# Altium schematic sheet MCU.SchDoc
size A2
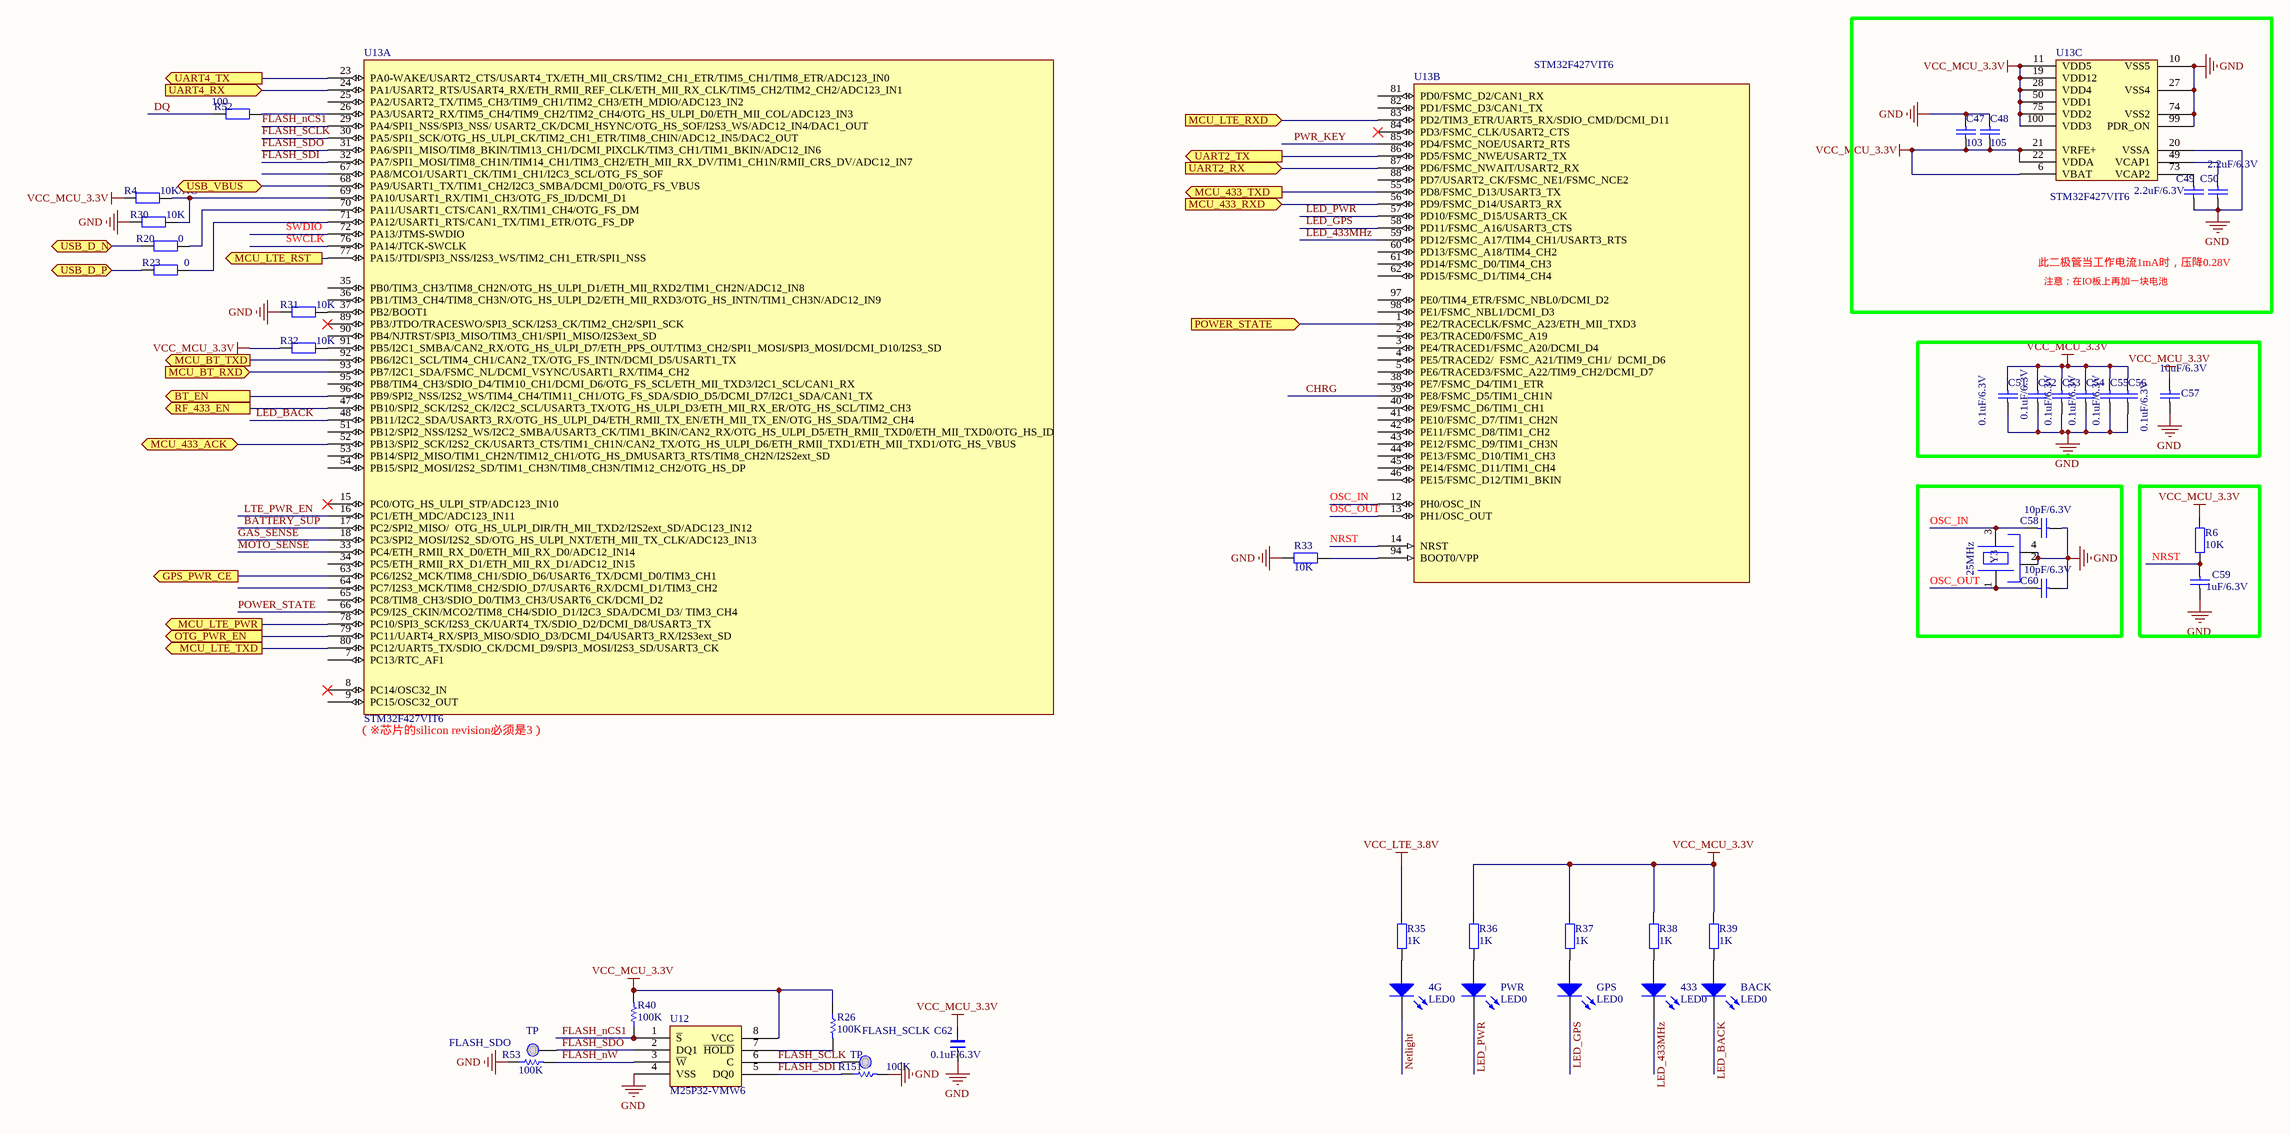
[diagram p0: MCU.SchDoc]

## Parts
4G  LED0  [LED_DIP_3mm]
433  LED0  [LED_DIP_3mm]
BACK  LED0  [LED_DIP_3mm]
C47  103  [0603C]
C48  105  [0603C]
C49  2.2uF/6.3V  [0603C]
C50  2.2uF/6.3V  [0603C]
C51  0.1uF/6.3V  [0603C]
C52  0.1uF/6.3V  [0603C]
C53  0.1uF/6.3V  [0603C]
C54  0.1uF/6.3V  [0603C]
C55  0.1uF/6.3V  [0603C]
C56  0.1uF/6.3V  [0603C]
C57  10uF/6.3V  [0805C]
C58  10pF/6.3V  [0603C]
C59  1uF/6.3V  [0603C]
C60  10pF/6.3V  [0603C]
C62  0.1uF/6.3V  [0603C]
FLASH_SCLK  TP  [tpd]
FLASH_SDO  TP  [tpd]
GPS  LED0  [LED_DIP_3mm]
PWR  LED0  [LED_DIP_3mm]
R4  value 10K/NC  [0603R]  (hidden comment: 10K)
R6  10K  [0603R]
R20  0  [0603R]
R23  0  [0603R]
R26  100K  [0603R]
R30  10K  [0603R]
R31  10K  [0603R]
R32  10K  [0603R]
R33  10K  [0603R]
R35  1K  [0603R]
R36  1K  [0603R]
R37  1K  [0603R]
R38  1K  [0603R]
R39  1K  [0603R]
R40  100K  [0603R]
R52  100  [0603R]
R53  100K  [0603R]
R151  100K  [0603R]
U12  M25P32-VMW6  [SOIC127P790X216-8N]
U13  STM32F427VIT6  [LQFQ100-stm32f103v]  (parts A,B,C of 3)
Y3  25MHz  [OSCILLATOR-3.2X2.5]

## Blocks framed on the sheet
此二极管当工作电流1mA时，压降0.28V: C47-C50 U13

## Ports
BT_EN (out), GPS_PWR_CE (out), MCU_433_ACK (bidir), MCU_433_RXD (in), MCU_433_TXD (out), MCU_BT_RXD (in), MCU_BT_TXD (out), MCU_LTE_PWR (out), MCU_LTE_RST (out), MCU_LTE_RXD (in), MCU_LTE_TXD (out), OTG_PWR_EN (out), POWER_STATE (in), RF_433_EN (out), UART2_RX (in), UART2_TX (out), UART4_RX (in), UART4_TX (out), USB_D_N, USB_D_P, USB_VBUS (bidir)

## Nets
GND: C47.2 C48.2 C49.1 C50.1 C51.1 C52.1 C53.1 C54.1 C55.1 C56.1 C57.2 C58.1 C59.1 C60.1 C62.1 R30.2 R31.2 R33.2 R53.1 R151.2 U12.4(VSS) U13.10(VSS5) U13.20(VSSA) U13.27(VSS4) U13.74(VSS2) U13.99(PDR_ON) Y3.2(GND) Y3.4(GND)
VCC_LTE_3.8V: R35.1
VCC_MCU_3.3V: C47.1 C48.1 C51.2 C52.2 C53.2 C54.2 C55.2 C56.2 C57.1 C62.2 R4.2 R6.2 R26.1 R32.2 R36.1 R37.1 R38.1 R39.1 R40.2 U12.8(VCC) U13.6(VBAT) U13.11(VDD5) U13.19(VDD12) U13.21(VRFE+) U13.22(VDDA) U13.28(VDD4) U13.50(VDD1) U13.75(VDD2) U13.100(VDD3)
BATTERY_SUP: U13.17(PC2/SPI2_MISO/__OTG_HS_ULPI_DIR/TH_MII_TXD2/I2S2ext_SD/ADC123_IN12)
BT_EN: U13.96(PB9/SPI2_NSS/I2S2_WS/TIM4_CH4/TIM11_CH1/OTG_FS_SDA/SDIO_D5/DCMI_D7/I2C1_SDA/CAN1_TX) ; port BT_EN
CHRG: U13.39(PE8/FSMC_D5/TIM1_CH1N)
DQ: R52.2
FLASH_nCS1: R40.1 U12.1(~{S}) U13.29(PA4/SPI1_NSS/SPI3_NSS/_USART2_CK/DCMI_HSYNC/OTG_HS_SOF/I2S3_WS/ADC12_IN4/DAC1_OUT)
FLASH_nW: R53.2 U12.3(~{W})
FLASH_SCLK: FLASH_SCLK.1 U12.6(C) U13.30(PA5/SPI1_SCK/OTG_HS_ULPI_CK/TIM2_CH1_ETR/TIM8_CHIN/ADC12_IN5/DAC2_OUT)
FLASH_SDI: R151.1 U12.5(DQ0) U13.32(PA7/SPI1_MOSI/TIM8_CH1N/TIM14_CH1/TIM3_CH2/ETH_MII_RX_DV/TIM1_CH1N/RMII_CRS_DV/ADC12_IN7)
FLASH_SDO: FLASH_SDO.1 U12.2(DQ1) U13.31(PA6/SPI1_MISO/TIM8_BKIN/TIM13_CH1/DCMI_PIXCLK/TIM3_CH1/TIM1_BKIN/ADC12_IN6)
GAS_SENSE: U13.18(PC3/SPI2_MOSI/I2S2_SD/OTG_HS_ULPI_NXT/ETH_MII_TX_CLK/ADC123_IN13)
GPS_PWR_CE: U13.63(PC6/I2S2_MCK/TIM8_CH1/SDIO_D6/USART6_TX/DCMI_D0/TIM3_CH1) ; port GPS_PWR_CE
LED_433MHz: 433.2(K) U13.59(PD12/FSMC_A17/TIM4_CH1/USART3_RTS)
LED_BACK: BACK.2(K) U13.48(PB11/I2C2_SDA/USART3_RX/OTG_HS_ULPI_D4/ETH_RMII_TX_EN/ETH_MII_TX_EN/OTG_HS_SDA/TIM2_CH4)
LED_GPS: GPS.2(K) U13.58(PD11/FSMC_A16/USART3_CTS)
LED_PWR: PWR.2(K) U13.57(PD10/FSMC_D15/USART3_CK)
LTE_PWR_EN: U13.16(PC1/ETH_MDC/ADC123_IN11)
MCU_433_ACK: U13.52(PB13/SPI2_SCK/I2S2_CK/USART3_CTS/TIM1_CH1N/CAN2_TX/OTG_HS_ULPI_D6/ETH_RMII_TXD1/ETH_MII_TXD1/OTG_HS_VBUS) ; port MCU_433_ACK
MCU_433_RXD: U13.56(PD9/FSMC_D14/USART3_RX) ; port MCU_433_RXD
MCU_433_TXD: U13.55(PD8/FSMC_D13/USART3_TX) ; port MCU_433_TXD
MCU_BT_RXD: U13.93(PB7/I2C1_SDA/FSMC_NL/DCMI_VSYNC/USART1_RX/TIM4_CH2) ; port MCU_BT_RXD
MCU_BT_TXD: U13.92(PB6/I2C1_SCL/TIM4_CH1/CAN2_TX/OTG_FS_INTN/DCMI_D5/USART1_TX) ; port MCU_BT_TXD
MCU_LTE_PWR: U13.78(PC10/SPI3_SCK/I2S3_CK/UART4_TX/SDIO_D2/DCMI_D8/USART3_TX) ; port MCU_LTE_PWR
MCU_LTE_RST: U13.77(PA15/JTDI/SPI3_NSS/I2S3_WS/TIM2_CH1_ETR/SPI1_NSS) ; port MCU_LTE_RST
MCU_LTE_RXD: U13.83(PD2/TIM3_ETR/UART5_RX/SDIO_CMD/DCMI_D11) ; port MCU_LTE_RXD
MCU_LTE_TXD: U13.80(PC12/UART5_TX/SDIO_CK/DCMI_D9/SPI3_MOSI/I2S3_SD/USART3_CK) ; port MCU_LTE_TXD
MOTO_SENSE: U13.33(PC4/ETH_RMII_RX_D0/ETH_MII_RX_D0/ADC12_IN14)
Netlight: 4G.2(K)
NRST: C59.2 R6.1 U13.14(NRST)
OSC_IN: C58.2 U13.12(PH0/OSC_IN) Y3.3
OSC_OUT: C60.2 U13.13(PH1/OSC_OUT) Y3.1
OTG_PWR_EN: U13.79(PC11/UART4_RX/SPI3_MISO/SDIO_D3/DCMI_D4/USART3_RX/I2S3ext_SD) ; port OTG_PWR_EN
POWER_STATE: U13.66(PC9/I2S_CKIN/MCO2/TIM8_CH4/SDIO_D1/I2C3_SDA/DCMI_D3/_TIM3_CH4)
POWER_STATE: U13.1(PE2/TRACECLK/FSMC_A23/ETH_MII_TXD3) ; port POWER_STATE  [a separate net that carries the same name]
PWR_KEY: U13.85(PD4/FSMC_NOE/USART2_RTS)
RF_433_EN: U13.47(PB10/SPI2_SCK/I2S2_CK/I2C2_SCL/USART3_TX/OTG_HS_ULPI_D3/ETH_MII_RX_ER/OTG_HS_SCL/TIM2_CH3) ; port RF_433_EN
SWCLK: U13.76(PA14/JTCK-SWCLK)
SWDIO: U13.72(PA13/JTMS-SWDIO)
UART2_RX: U13.87(PD6/FSMC_NWAIT/USART2_RX) ; port UART2_RX
UART2_TX: U13.86(PD5/FSMC_NWE/USART2_TX) ; port UART2_TX
UART4_RX: U13.24(PA1/USART2_RTS/USART4_RX/ETH_RMII_REF_CLK/ETH_MII_RX_CLK/TIM5_CH2/TIM2_CH2/ADC123_IN1) ; port UART4_RX
UART4_TX: U13.23(PA0-WAKE/USART2_CTS/USART4_TX/ETH_MII_CRS/TIM2_CH1_ETR/TIM5_CH1/TIM8_ETR/ADC123_IN0) ; port UART4_TX
USB_D_N: R20.2 ; port USB_D_N
USB_D_P: R23.2 ; port USB_D_P
USB_VBUS: U13.68(PA9/USART1_TX/TIM1_CH2/I2C3_SMBA/DCMI_D0/OTG_FS_VBUS) ; port USB_VBUS
Net4G_1: 4G.1(A) R35.2
Net433_1: 433.1(A) R38.2
NetBACK_1: BACK.1(A) R39.2
NetC49_2: C49.2 U13.73(VCAP2)
NetC50_2: C50.2 U13.49(VCAP1)
NetGPS_1: GPS.1(A) R37.2
NetPWR_1: PWR.1(A) R36.2
NetR4_1: R4.1 R30.1 U13.69(PA10/USART1_RX/TIM1_CH3/OTG_FS_ID/DCMI_D1)
NetR20_1: R20.1 U13.70(PA11/USART1_CTS/CAN1_RX/TIM1_CH4/OTG_FS_DM)
NetR23_1: R23.1 U13.71(PA12/USART1_RTS/CAN1_TX/TIM1_ETR/OTG_FS_DP)
NetR26_2: R26.2 U12.7(~{HOLD})
NetR31_1: R31.1 U13.37(PB2/BOOT1)
NetR32_1: R32.1 U13.91(PB5/I2C1_SMBA/CAN2_RX/OTG_HS_ULPI_D7/ETH_PPS_OUT/TIM3_CH2/SPI1_MOSI/SPI3_MOSI/DCMI_D10/I2S3_SD)
NetR33_1: R33.1 U13.94(BOOT0/VPP)
NetR52_1: R52.1 U13.26(PA3/USART2_RX/TIM5_CH4/TIM9_CH2/TIM2_CH4/OTG_HS_ULPI_D0/ETH_MII_COL/ADC123_IN3)

Not connected (* = marked no-connect by the designer): U13 2(PE3/TRACED0/FSMC_A19) 3(PE4/TRACED1/FSMC_A20/DCMI_D4) 4(PE5/TRACED2/__FSMC_A21/TIM9_CH1/__DCMI_D6) 5(PE6/TRACED3/FSMC_A22/TIM9_CH2/DCMI_D7) 7(PC13/RTC_AF1) 8(PC14/OSC32_IN)* 9(PC15/OSC32_OUT) 15(PC0/OTG_HS_ULPI_STP/ADC123_IN10)* 25(PA2/USART2_TX/TIM5_CH3/TIM9_CH1/TIM2_CH3/ETH_MDIO/ADC123_IN2) 34(PC5/ETH_RMII_RX_D1/ETH_MII_RX_D1/ADC12_IN15) 35(PB0/TIM3_CH3/TIM8_CH2N/OTG_HS_ULPI_D1/ETH_MII_RXD2/TIM1_CH2N/ADC12_IN8) 36(PB1/TIM3_CH4/TIM8_CH3N/OTG_HS_ULPI_D2/ETH_MII_RXD3/OTG_HS_INTN/TIM1_CH3N/ADC12_IN9) 38(PE7/FSMC_D4/TIM1_ETR) 40(PE9/FSMC_D6/TIM1_CH1) 41(PE10/FSMC_D7/TIM1_CH2N) 42(PE11/FSMC_D8/TIM1_CH2) 43(PE12/FSMC_D9/TIM1_CH3N) 44(PE13/FSMC_D10/TIM1_CH3) 45(PE14/FSMC_D11/TIM1_CH4) 46(PE15/FSMC_D12/TIM1_BKIN) 51(PB12/SPI2_NSS/I2S2_WS/I2C2_SMBA/USART3_CK/TIM1_BKIN/CAN2_RX/OTG_HS_ULPI_D5/ETH_RMII_TXD0/ETH_MII_TXD0/OTG_HS_ID) 53(PB14/SPI2_MISO/TIM1_CH2N/TIM12_CH1/OTG_HS_DMUSART3_RTS/TIM8_CH2N/I2S2ext_SD) 54(PB15/SPI2_MOSI/I2S2_SD/TIM1_CH3N/TIM8_CH3N/TIM12_CH2/OTG_HS_DP) 60(PD13/FSMC_A18/TIM4_CH2) 61(PD14/FSMC_D0/TIM4_CH3) 62(PD15/FSMC_D1/TIM4_CH4) 64(PC7/I2S3_MCK/TIM8_CH2/SDIO_D7/USART6_RX/DCMI_D1/TIM3_CH2) 65(PC8/TIM8_CH3/SDIO_D0/TIM3_CH3/USART6_CK/DCMI_D2) 67(PA8/MCO1/USART1_CK/TIM1_CH1/I2C3_SCL/OTG_FS_SOF) 81(PD0/FSMC_D2/CAN1_RX) 82(PD1/FSMC_D3/CAN1_TX) 84(PD3/FSMC_CLK/USART2_CTS)* 88(PD7/USART2_CK/FSMC_NE1/FSMC_NCE2) 89(PB3/JTDO/TRACESWO/SPI3_SCK/I2S3_CK/TIM2_CH2/SPI1_SCK)* 90(PB4/NJTRST/SPI3_MISO/TIM3_CH1/SPI1_MISO/I2S3ext_SD) 95(PB8/TIM4_CH3/SDIO_D4/TIM10_CH1/DCMI_D6/OTG_FS_SCL/ETH_MII_TXD3/I2C1_SCL/CAN1_RX) 97(PE0/TIM4_ETR/FSMC_NBL0/DCMI_D2) 98(PE1/FSMC_NBL1/DCMI_D3)

## Notes on the sheet
- 注意：在IO板上再加一块电池
- (near U13) （※芯片的silicon revision必须是3）

## Library data of the parts
4G 433 BACK GPS PWR = LED0: Typical INFRARED GaAs LED; Published: 8-Jun-2000; LatestRevisionDate: 08-Jul-2005; LatestRevisionNote: Mech Layer 1 removed.; PackageReference: LED-0; Publisher: Altium Limited
C47 C48 = Cap: Capacitor; Published: 8-Jun-2000; LatestRevisionDate: 17-Jul-2002; LatestRevisionNote: Re-released for DXP Platform.; PackageReference: RAD-0.3; Publisher: Altium Limited
  C47: Value: 103
  C48: Value: 105
C49 C50 = Cap: Capacitor; Value: 2.2uF; Published: 8-Jun-2000; LatestRevisionDate: 17-Jul-2002; LatestRevisionNote: Re-released for DXP Platform.; PackageReference: RAD-0.3; Publisher: Altium Limited
C51-C56 = Cap: Capacitor; Value: 104; Published: 8-Jun-2000; LatestRevisionDate: 17-Jul-2002; LatestRevisionNote: Re-released for DXP Platform.; PackageReference: RAD-0.3; Publisher: Altium Limited
C57 = Cap: Capacitor; Value: 106; Published: 8-Jun-2000; LatestRevisionDate: 17-Jul-2002; LatestRevisionNote: Re-released for DXP Platform.; PackageReference: RAD-0.3; Publisher: Altium Limited
C58 C60 = Cap: Capacitor; Value: 10pF; Published: 8-Jun-2000; LatestRevisionDate: 17-Jul-2002; LatestRevisionNote: Re-released for DXP Platform.; PackageReference: RAD-0.3; Publisher: Altium Limited
C59 = Cap: Capacitor; Value: 105; Published: 8-Jun-2000; LatestRevisionDate: 17-Jul-2002; LatestRevisionNote: Re-released for DXP Platform.; PackageReference: RAD-0.3; Publisher: Altium Limited
C62 = C
R4 R6 R30-R33 R35-R39 = Res2: Resistor; Published: 8-Jun-2000; LatestRevisionDate: 17-Jul-2002; LatestRevisionNote: Re-released for DXP Platform.; PackageReference: AXIAL-0.4; Publisher: Altium Limited
  R6 R30-R33: Value: 10K
  R35-R39: Value: 1K
R20 R23 R52 = Res2: Resistor; Value: 10K; Published: 8-Jun-2000; LatestRevisionDate: 17-Jul-2002; LatestRevisionNote: Re-released for DXP Platform.; PackageReference: AXIAL-0.4; Publisher: Altium Limited
R26 R40 R53 R151 = Res1: Resistor; Published: 8-Jun-2000; LatestRevisionDate: 17-Jul-2002; LatestRevisionNote: Re-released for DXP Platform.; PackageReference: AXIAL-0.3; Publisher: Altium Limited
U12 = M25P16-VMN6TPBA
U13 = STM32F407VGT6
Y3 = XTAL3